# Altium schematic sheet VJ111.SchDoc
size A4
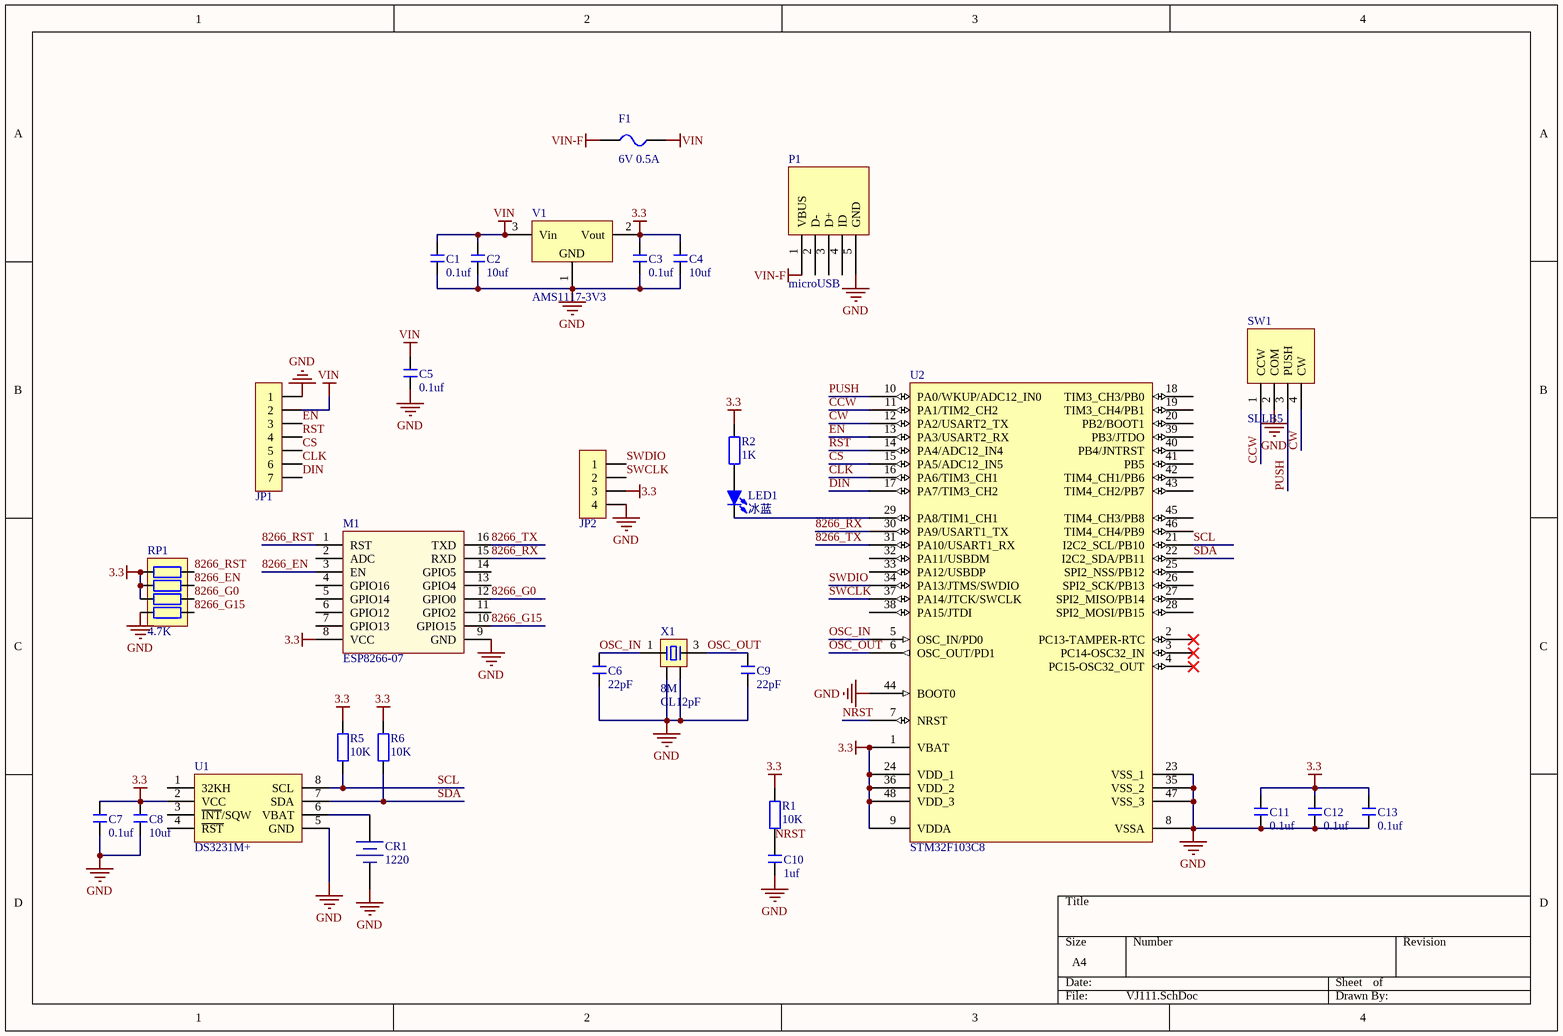
[diagram p0: VJ111.SchDoc]

## Parts
C1  0.1uf  [C 0603_L]
C2  10uf  [C 0603_L]
C3  0.1uf  [C 0603_L]
C4  10uf  [C 0603_L]
C5  0.1uf  [C 0603_L]
C6  22pF  [C 0603_L]
C7  0.1uf  [C 0603_L]
C8  10uf  [C 0603_L]
C9  22pF  [C 0603_L]
C10  1uf  [C 0603_L]
C11  0.1uf  [C 0603_L]
C12  0.1uf  [C 0603_L]
C13  0.1uf  [C 0603_L]
CR1  1220  [CR1220_A]
F1  6V 0.5A  [FU 0805]
JP1  HDR-1X7  [HDR2.54-LI-7P]  (value not drawn)
JP2  HDR-1X4  [HDR2.54-LI-4P]  (value not drawn)
LED1  冰蓝  [LED 0603B]
M1  ESP8266-07  [ESP-07]
P1  microUSB  [microUSB]
R1  10K  [R 0603_L]
R2  1K  [R 0603_L]
R5  10K  [R 0603_L]
R6  10K  [R 0603_L]
RP1  4.7K  [RCA-8P4R-0603]
SW1  SLLB5  [SLLB510100]
U1  DS3231M+  [SOP8_N]
U2  STM32F103C8  [LQFP48 7X7_N]
V1  AMS1117-3V3  [SOT223_L]
X1  8M  负载电容: CL12pF  [OSC 3225-4P]

## Nets
3.3: C3.2 C4.2 C7.2 C8.2 C11.2 C12.2 C13.2 JP2.3 M1.8(VCC) R1.2 R2.2 R5.2 R6.2 RP1.1 RP1.2 RP1.3 U1.2(VCC) U2.1(VBAT) U2.9(VDDA) U2.24(VDD_1) U2.36(VDD_2) U2.48(VDD_3) V1.2(Vout)
GND: C1.1 C2.1 C3.1 C4.1 C5.2 C6.1 C7.1 C8.1 C9.1 C10.1 C11.1 C12.1 C13.1 CR1.2(DC-) JP1.1 JP2.4 M1.9(GND) P1.5(GND) RP1.4 SW1.2(COM) U1.5(GND) U2.8(VSSA) U2.23(VSS_1) U2.35(VSS_2) U2.44(BOOT0) U2.47(VSS_3) V1.1(GND) X1.2 X1.4
VIN: C1.2 C2.2 C5.1 F1.2 JP1.2 V1.3(Vin)
VIN-F: F1.1 P1.1(VBUS)
8266_EN: M1.3(EN) RP1.7
8266_G0: M1.12(GPIO0) RP1.6
8266_G15: M1.10(GPIO15) RP1.5
8266_RST: M1.1(RST) RP1.8
8266_RX: M1.15(RXD) U2.30(PA9/USART1_TX)
8266_TX: M1.16(TXD) U2.31(PA10/USART1_RX)
CCW: SW1.1(CCW) U2.11(PA1/TIM2_CH2)
CLK: JP1.6 U2.16(PA6/TIM3_CH1)
CS: JP1.5 U2.15(PA5/ADC12_IN5)
CW: SW1.4(CW) U2.12(PA2/USART2_TX)
DIN: JP1.7 U2.17(PA7/TIM3_CH2)
EN: JP1.3 U2.13(PA3/USART2_RX)
NRST: C10.2 R1.1 U2.7(NRST)
OSC_IN: C6.2 U2.5(OSC_IN/PD0) X1.1
OSC_OUT: C9.2 U2.6(OSC_OUT/PD1) X1.3
PUSH: SW1.3(PUSH) U2.10(PA0/WKUP/ADC12_IN0)
RST: JP1.4 U2.14(PA4/ADC12_IN4)
SCL: R5.1 U1.8(SCL) U2.21(I2C2_SCL/PB10)
SDA: R6.1 U1.7(SDA) U2.22(I2C2_SDA/PB11)
SWCLK: JP2.2 U2.37(PA14/JTCK/SWCLK)
SWDIO: JP2.1 U2.34(PA13/JTMS/SWDIO)
NetCR1_1: CR1.1(DC+) U1.6(VBAT)
NetLED1_1: LED1.1(A) R2.1
NetLED1_2: LED1.2(K) U2.29(PA8/TIM1_CH1)

Not connected (* = marked no-connect by the designer): M1 2(ADC) 4(GPIO16) 5(GPIO14) 6(GPIO12) 7(GPIO13) 11(GPIO2) 13(GPIO4) 14(GPIO5); P1 2(D-) 3(D+) 4(ID); U1 1(32KH) 3(~{INT}/SQW) 4(~{RST}); U2 2(PC13-TAMPER-RTC)* 3(PC14-OSC32_IN)* 4(PC15-OSC32_OUT)* 18(TIM3_CH3/PB0) 19(TIM3_CH4/PB1) 20(PB2/BOOT1) 25(SPI2_NSS/PB12) 26(SPI2_SCK/PB13) 27(SPI2_MISO/PB14) 28(SPI2_MOSI/PB15) 32(PA11/USBDM) 33(PA12/USBDP) 38(PA15/JTDI) 39(PB3/JTDO) 40(PB4/JNTRST) 41(PB5) 42(TIM4_CH1/PB6) 43(TIM4_CH2/PB7) 45(TIM4_CH3/PB8) 46(TIM4_CH4/PB9)

## Library data of the parts
C1-C5 C11-C13 = C: 无极性贴片电容; 版权归属: 源创客; 材质: X7R; BOM名称: 无极性贴片电容; 学习资源: www.ooocke.com
C6-C10 = C: 无极性贴片电容; 版权归属: 源创客; BOM名称: 无极性贴片电容; 学习资源: www.ooocke.com
CR1 = CR-3V: 微型电池; 版权归属: 源创客; BOM名称: 微型电池; 学习资源: www.ooocke.com
F1 = FU: 贴片保险丝; 版权归属: 源创客; BOM名称: 贴片保险丝; 学习资源: www.ooocke.com
JP1 = Header 7: 7P接插件; 版权归属: 源创客; BOM名称: 7P接插件; 学习资源: www.ooocke.com
JP2 = Header 4: 4P接插件; 版权归属: 源创客; BOM名称: 4P接插件; 学习资源: www.ooocke.com
LED1 = LED-SMD: 贴片LED; 版权归属: 源创客; BOM名称: 贴片LED; 学习资源: www.ooocke.com
M1 = ESP8266-07: 串口 WIFI模块，ESP-07; BOM名称: WIFI模块; 版权归属: 源创客; 学习资源: www.ooocke.com
R1 R2 R5 R6 = R: 贴片电阻; 版权归属: 源创客; BOM名称: 贴片电阻; 学习资源: www.ooocke.com
RP1 = R-8P4R: 贴片网络排阻; 版权归属: 源创客; BOM名称: 贴片网络排阻; 学习资源: www.ooocke.com
SW1 = SLLB5: 操作杆和按动操作型开关
U2 = STM32F103C8: Flaah:64/RAM:20/IO:36; BOM名称: 32位STM单片机; 版权归属: 源创客; 学习资源: www.ooocke.com
V1 = AMS1117: 三端稳压芯片; BOM名称: 稳压芯片; 版权归属: 源创客; 学习资源: www.ooocke.com
X1 = XTAL-4P: 4脚无源晶振; 版权归属: 源创客; BOM名称: 4脚无源晶振; 学习资源: www.ooocke.com